# Altium schematic sheet dcdc_60v_12v.SchDoc
size A4; SheetNumber: 5; SheetTotal: 6; SPICEModelCacheOFSRASBJ: <root> / <DocumentId>OFSRASBJ</DocumentId> / <CacheFrame Number="0"> / <Model Name="tmk325b7226_m-pr" Kind="CKT"> / <Text>* TMK325B7226_M-PR     SPICE MODEL  ( General Type ) / *-------------------------------------------------------------------------------------------------------- / * Model Generated by TAIYO YUDEN Corporation (http://www.ty-top.com) / * Version 1.0 / * TAIYO YUDEN Control No. 170508_150330 / * Copyright(c) 2015 TAIYO YUDEN CO.,LTD. All Rights Reserved. / *-------------------------------------------------------------------------------------------------------- / * / * Products Name : Multilayer Ceramic Capacitors / * / * Characteristics : / *     Capacitance : 22 uF , Rated Voltage : 25V , TCC : X7R / *     Case Size : 3.2 x 2.5 / 0.126 x 0.098 [mm/inch] , Thickness : 2.5 / 0.098 [mm/inch] / *     (Conditions: Temperature = 25 degC , DC Bias Current/Voltage = 0A / 0V) / * / * Frequency Range : 40Hz - 3GHz / * / * External Node Assignments : / * / *  1  o---| |---o  2 / * / *-------------------------------------------------------------------------------------------------------- / .SubCkt TMK325B7226_M-PR 1 2 / **************************** / C0 1 110 20.232u / Cm 1 101 1.4192u / C1 101 102 0.46072u / Rc1 101 102 383.24 / C2 102 103 0.25707u / Rc2 102 103 27.255 / C3 103 110 0.063707u / Rc3 103 110 9.0927 / C2m 1 301 2.8514u / C21 301 302 4.5381u / Rc21 301 302 971.82 / C22 302 303 5.7922u / Rc22 302 303 294.55 / C23 303 304 5.617u / Rc23 303 304 301.8 / C24 304 305 2.3653u / Rc24 304 305 34.154 / C25 305 306 1.0031u / Rc25 305 306 28.966 / C26 306 307 0.1463u / Rc26 306 307 1.8028 / C27 307 308 0.26562u / Rc27 307 308 0.93359 / C28 308 309 0.29812u / Rc28 308 309 0.7461 / C29 309 110 3869.2p / Rc29 309 110 3.935 / Rp0 1 110 4.54545454545455Meg / L0 110 120 0.19079n / Lm 120 130 0.18902n / L1 120 121 0.21321n / RL1 121 130 0.13225 / L2 120 122 0.31017n / RL2 122 130 0.16258 / L3 120 123 1.2596n / RL3 123 130 144.01 / CR 120 124 3.8286u / LR 124 125 0.37731n / RR 125 130 10.878m / CL 130 140 3.0471p / LL 130 140 0.15642n / RL 130 140 11.971 / Rs 140 2 2.3557m / **************************** / .ends TMK325B7226_M-PR</Text> / </Model> / </CacheFrame> / </root>
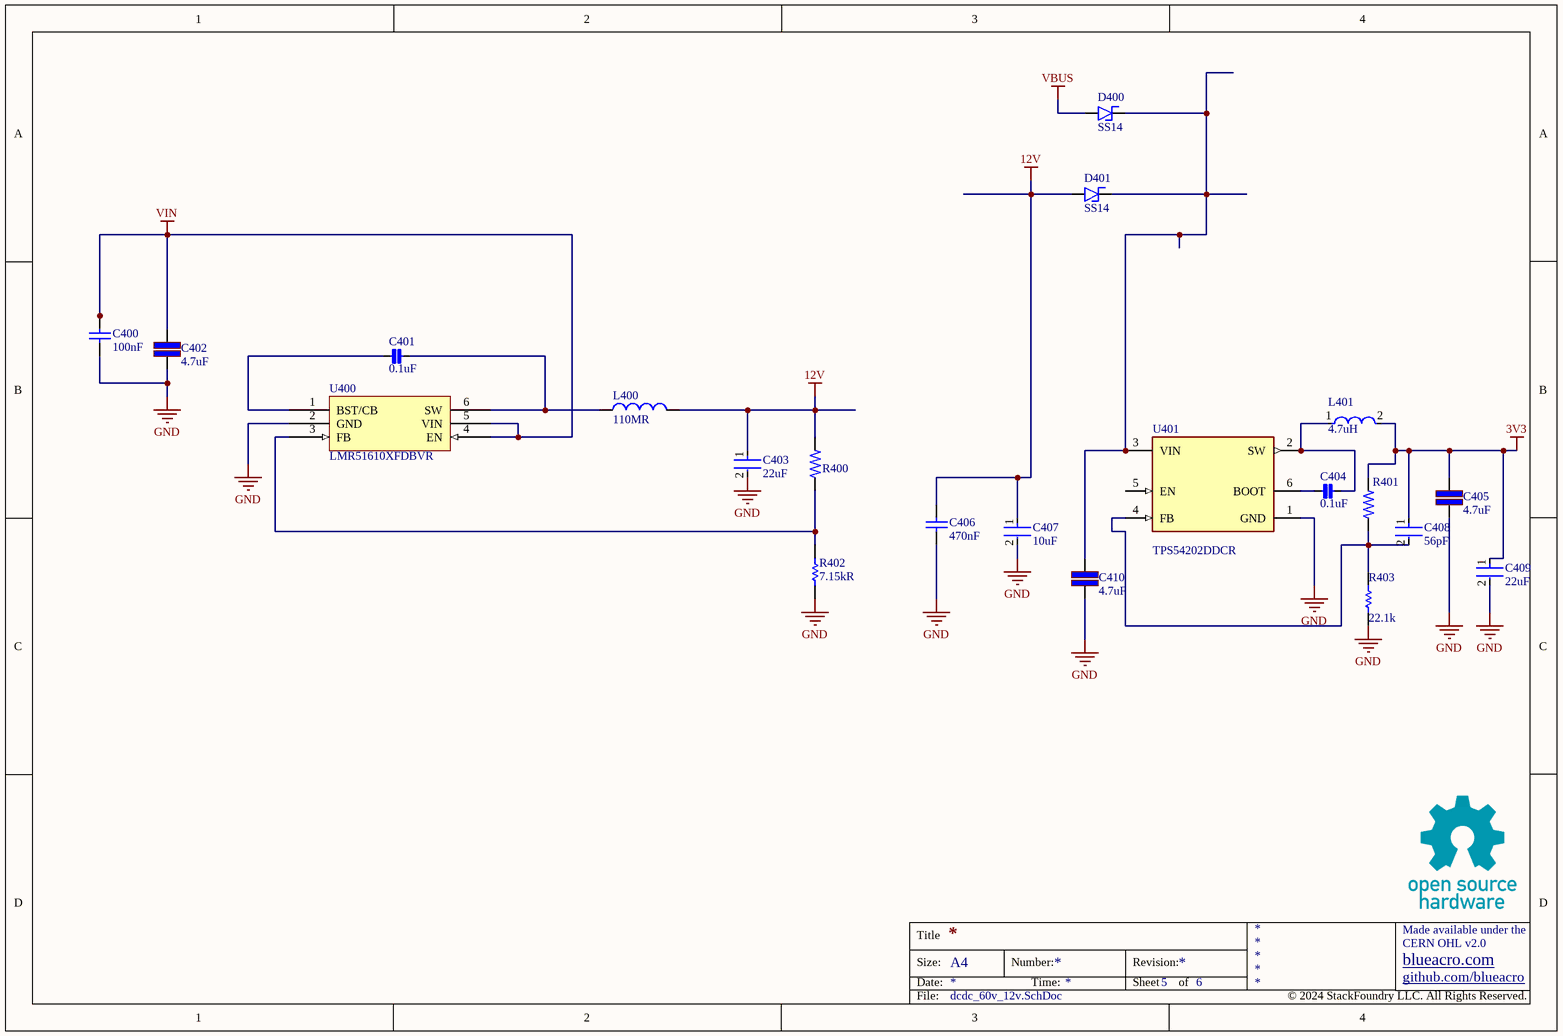
[diagram p0: dcdc_60v_12v.SchDoc]

## Parts
C400  value 100nF  [CAPC2013X94X50ML20T25]  (hidden comment: 0.1uF X7R 100V 0805)
C401  value 0.1uF  [FP-CL10-IPC_B]  (hidden comment: CAP 0.1uF 50V X7R 0603)
C402  value 4.7uF  [CAPC3225X20N]  (hidden comment: CAP 4.7uF 50V X7R 1210)
C403  value 22uF  [FP-1210-L_3_2_0_3-W_2_5_0-MFG]  (hidden comment: CAP 22uF 25V 1210 X7R)
C404  value 0.1uF  [FP-CL10-IPC_B]  (hidden comment: CAP 0.1uF 50V X7R 0603)
C405  value 4.7uF  [CAPC3225X20N]  (hidden comment: CAP 4.7uF 50V X7R 1210)
C406  value 470nF  [CAPC1210(3225)230_M]  (hidden comment: CAP 0.47uF 1210 50V X7R)
C407  value 10uF  [FP-GRM32E-0_2-0_3-MFG]  (hidden comment: CAP 10uF 1210 63V X7R)
C408  value 56pF  [FP-C0603C-CF-IPC_B]  (hidden comment: C0603C560J5GACTU)
C409  value 22uF  [FP-1210-L_3_2_0_3-W_2_5_0-MFG]  (hidden comment: CAP 22uF 25V 1210 X7R)
C410  value 4.7uF  [CAPC3225X20N]  (hidden comment: CAP 4.7uF 50V X7R 1210)
D400  SS14  [SMA]
D401  SS14  [SMA]
L400  value 110MR  [SRR1260-680M-Footprint-1]  (hidden comment: SRR1260-680M)
L401  value 4.7uH  [FP-SRN4018-MFG]  (hidden comment: SRN4018-4R7M)
R400  100k 0603 1%  [RESC1608-IPC-LL]  (value not drawn)
R401  100k 0603 1%  [RESC1608-IPC-LL]  (value not drawn)
R402  value 7.15kR  [RESC1608X55X30NL20T20]  (hidden comment: 7.15k 0603 0.1%)
R403  value 22.1k  [RESC1608-IPC-LL]  (hidden comment: 22.1k 0603 0.1%)
U400  LMR51610XFDBVR  [SOT95P280X145-6N]
U401  TPS54202DDCR  [FP-DDC0006A-IPC_C]

## Nets
3V3: C405.2 C408.1 C409.1 L401.2 R401.2
12V: C403.1 C406.2 C407.1 D401.A L400.2 R400.2
GND: C400.1 C402.1 C403.2 C405.1 C406.1 C407.2 C409.2 C410.1 R402.1 R403.1 U400.2(GND) U401.1(GND)
VBUS: D400.A
VIN: C400.2 C402.2 U400.4(EN) U400.5(VIN)
NetC401_1: C401.1 U400.1(BST/CB)
NetC401_2: C401.2 L400.1 U400.6(SW)
NetC404_1: C404.1 U401.6(BOOT)
NetC404_2: C404.2 L401.1 U401.2(SW)
NetC408_2: C408.2 R401.1 R403.2 U401.4(FB)
NetC410_2: C410.2 D400.K D401.K U401.3(VIN)
NetR400_1: R400.1 R402.2 U400.3(FB)

Not connected (* = marked no-connect by the designer): U401 5(EN)

## Notes on the sheet
- Title
- Size:
- Date:
- A4
- Number:
- Time:
- Revision:
- Sheet
- of
- github.com/blueacro
- blueacro.com
- CERN OHL v2.0
- Made available under the
- File:
- © 2024 StackFoundry LLC. All Rights Reserved.

## Library data of the parts
C400 = CMP-001-00130-1: Ceramic Capacitor, Multilayer, Ceramic, 100V, 5% +Tol, 5% -Tol, X7R, 15% TC, 0.1uF, Surface Mount, 0805; Multilayer: Yes; Packaging: Tape and Reel; Case/Package: 0805; RoHS Compliant: Yes; JESD-609 Code: e3; Temperature Characteristics Code: X7R; Tolerance  (fill in as +-): 5%; Height: 1.4mm; Tolerance (fill in as +-): 5%; Length: 2.01mm; Terminal Finish: Nickel; Package Style: SMTMeter; Mounting Technology: Surface Mount; Reach SVHC Compliant: Yes; Max Operating Temperature: 125°C; Termination: Wraparound; Dielectric Material: Ceramic; Width: 1.25mm; Min Operating Temperature: -55°C; Package Shape: Rectangular; Pins: 2; Capacitor Type: Ceramic; Rated DC Voltage (URdc): 100V
C401 C404 = CMP-001-00084-7: Cap Ceramic 0.1uF 50V X7R 20% SMD 0603 125C Paper T/R; Voltage: 50V
C402 C405 C410 = CMP-001-00083-3: CAP CER 4.7UF 50V X7R 1210; Tolerance: 10%; Material: Ceramic; Voltage: 50V; Capacitance: 4.7uF; Width: 0.098inch; Height: 1.8mm; Depth: 2.5mm; Package Quantity: 1; Case/Package: 1210; Case Code (Imperial): 1210; Contact Plating: Tin; Thickness: 0.079inch; Radiation Hardening: No; Voltage Rating: 50V; Packaging: Tape and Reel; Lead Free: Lead Free; Dielectric: X7R; Min Operating Temperature: -55°C; Case Code (Metric): 3225; Max Operating Temperature: 125°C; Mount: Surface Mount; Length: 3.2mm
C403 C409 = CMP-001-00125-1: 1210 22 uF 25 V ±20% Tolerance X7R Multilayer Ceramic Chip Capacitor; Tolerance: 20%; Series: M; Max Operating Temperature: 125°C; Min Operating Temperature: -55°C; Case Code (Metric): 3225; Mounting Technology: Surface Mount; Case/Package: 1210; RoHS Compliant: Yes; Voltage Rating: 25V; Packaging: Tape and Reel; Case Code (Imperial): 1210
C406 = CMP-001-00128-1: Multilayer Ceramic Capacitor, 0.47 uF, 50 V, ± 10%, X7R, 1210 [3225 Metric]; Height: 0.95mm; Tolerance: 10%; Length: 3.2mm; Voltage Rating: 50V; Depth: 2.5mm; Case Code (Metric): 3225; Voltage: 50V; Lead Free: Lead Free; Series: C; Dielectric: X7R; Dielectric Material: Ceramic; Construction: Flat; Case Code (Imperial): 1210; Case/Package: 1210; Thickness: 0.041inch; RoHS Compliant: Yes; Package Quantity: 1; Width: 0.098inch; Reach SVHC Compliant: No; Voltage Rating (DC): 50V; Termination: SMD/SMT; Min Operating Temperature: -55°C; Packaging: Tape and Reel; Mounting Technology: Surface Mount,PCB; Max Operating Temperature: 125°C
C407 = CMP-001-00119-1: Multilayer Ceramic Capacitors MLCC - SMD/SMT 1210 10uF 63volts *Derate Voltage/Temp; Tolerance: 10%; Series: GRM; Case Code (Metric): 3225; Case/Package: 1210; Voltage Rating: 63V; Case Code (Imperial): 1210; Voltage: 63V; Thickness: 0.106inch; Dielectric Material: Ceramic; Depth: 2.5mm; Material: Ceramic; Length: 3.2mm; Height: 2.5mm; Width: 2.5mm; Voltage Rating (DC): 63V; Termination: SMD/SMT; Dielectric: X7R
C408 = CMP-001-00126-1: Multilayer Ceramic Capacitor, 56 pF, 50 V, ± 5%, C0G (NP0), 0603 [1608 Metric]; Temperature Coefficient: 30ppm/°C; Voltage Rating (DC): 50V; Radiation Hardening: No; Min Operating Temperature: -55°C; Pins: 2; Depth: 0.8mm; Termination: SMD/SMT; Dielectric: C0G; Thickness: 0.034inch; Package Quantity: 1; RoHS Compliant: Yes; Reach SVHC Compliant: No; Lead Free: Lead Free; Length: 1.6mm; Mounting Technology: Surface Mount,PCB; Packaging: Tape and Reel; Width: 0.031inch; Height: 0.8mm; Material: Ceramic; Series: C; Case Code (Metric): 1608; Tolerance: 5%; Max Operating Temperature: 125°C; Lead Pitch: 0.7mm; Voltage Rating: 50V; Case Code (Imperial): 0603; Construction: Flat; Case/Package: 0603
D400 D401 = CMP-080-0002-2: Source: diode.SCHLIB; Design Item ID: DIODE_SCHOTTKY
L400 = CMP-006-00034-1: Ind Power Shielded Wirewound 68uH 20% 100KHz 22Q-Factor Ferrite 2.1A T/R; Q Factor: 22; Self Resonant Frequency: 7.43MHz; Material: Steel; Current Rating: 2.1A; Height - Seated (Max): 0.256inch; Termination: SMD/SMT; Inductance Tolerance: 20%; Package Quantity: 600; Tolerance: 20%; Max DC Current: 2.1A; Reach SVHC Compliant: No; Min Operating Temperature: -40°C; Test Frequency: 100kHz; Depth: 12.8mm; Saturation Current: 2.1A; Length: 12.5mm; Width: 12.5mm; Case/Package: 1260; RMS Current (Irms): 2.1A; Frequency: 7.43MHz; Mounting Technology: Surface Mount; Packaging: Tape and Reel; Pins: 2; DC Current: 2.1A; Shielding: Shielded; Max Operating Temperature: 125°C; Sample Rate (Hz): 100kHz; DC Resistance (DCR): 110mR; Height: 6mm; RoHS Compliant: Yes; Series: SRR1260; Military Standard: Not; Core Material: Ferrite
L401 = CMP-006-00036-2: Ind Power Semi-Shielded Wirewound 4.7uH 20% 100KHz Ferrite 1.9A 1515 T/R; Material: Steel; Self Resonant Frequency: 35MHz; DC Resistance (DCR): 84mR; Saturation Current: 2A; Q Factor: 9; Radiation Hardening: No; Reach SVHC Compliant: No; Sample Rate (Hz): 100kHz; Package Quantity: 3000; RoHS Compliant: Yes; Depth: 4.2mm; Max DC Current: 1.9A; Case/Package: Nonstandard; Min Operating Temperature: -25°C; Test Frequency: 100kHz; Max Operating Temperature: 120°C; Pins: 2; Shielding: Shielded; Packaging: Cut Tape; Height - Seated (Max): 0.071inch; Inductance Tolerance: 20%; RMS Current (Irms): 1.9A; Current Rating: 1.9A; Core Material: Ferrite; Width: 4mm; Height: 1.8mm; Tolerance: 20%; Length: 4mm; Series: SRN4018; Termination: SMD/SMT; Mounting Technology: Surface Mount; ESR: 84mR
R400 R401 = CMP-009-00203-1: Res Thick Film 1.6 x 0.8 mm 100K Ohm 1% 0.1W(1/10W) 100ppm/ C Molded SMD Paper T/R
R402 = CMP-009-00235-1: Res Thin Film 0603 7.15K Ohm 0.1% 1/10W ±25ppm/°C Molded SMD SMD Punched Carrier T/R; Voltage Rating: 75V; Power Rating: 100mW; Number of Terminations: 2; Temperature Coefficient: 25ppm/°C; Weight: 7.1E-05oz; Technology: METAL FILM; Contact Plating: Tin; Features: Automotive AEC-Q200; Height: 0.45mm; Termination: SMD/SMT; Case Code (Imperial): 0603; Pins: 2; Case Code (Metric): 1608; Depth: 0.8mm; Mounting Technology: Surface Mount; Reach SVHC Compliant: No; Packaging: Tape and Reel; Width: 0.8mm; Resistance Tolerance: 0.1%; Resistor Type: Thin Film; Min Operating Temperature: -55°C; Series: ERA; Ratings: AEC-Q200; RoHS Compliant: Yes; Case/Package: 0603; Length: 1.6mm; Package Quantity: 1; Voltage Rating (DC): 75V; Lead Free: Lead Free; Max Operating Temperature: 155°C; Max Power Dissipation: 100mW
R403 = CMP-009-00207-3: RES SMD 22.1KOHM 0.1% 1/10W 0603
U400 = CMP-019-00077-1: SIMPLE SWITCHER® power converter with 4.5V-to-65V 1A synchronous buck and 25µA quiescent current 6-SOT-23 -40 to 150
U401 = CMP-019-00081-1: 4.5V to 28V Input, 2A Output, EMI Friendly Synchronous Step-Down Converter 6-SOT-23-THIN -40 to 125; Min Output Voltage: 596mV; Synchronous Rectifier: Yes; Number of Outputs: 1; Output Type: Adjustable; Switching Frequency: 500kHz; Output Configuration: Positive; Max Duty Cycle: 100%; Quiescent Current: 40uA; Nominal Supply Current: 45uA; Mounting Technology: Surface Mount; Series: Eco-Mode™; RoHS Compliant: Yes; Packaging: Tape and Reel; Case/Package: SOT-23-6; Min Input Voltage: 4.5V; Min Operating Temperature: -40°C; Max Supply Voltage: 28V; Max Operating Temperature: 125°C; Max Output Voltage: 28V; Output Current: 2A; Width: 1.6mm; Thickness: 870um; Height: 1.1mm; Min Supply Voltage: 4.5V; Length: 2.9mm; Number of Channels: 1; Lead Free: Lead Free; Pins: 6